# Altium project multimodal_hw_00.PrjPcb (part 2 of 2)

## Sheet 10-multimodal-microcontroller-rf.SchDoc
size A; SheetNumber: 7; SheetTotal: 11
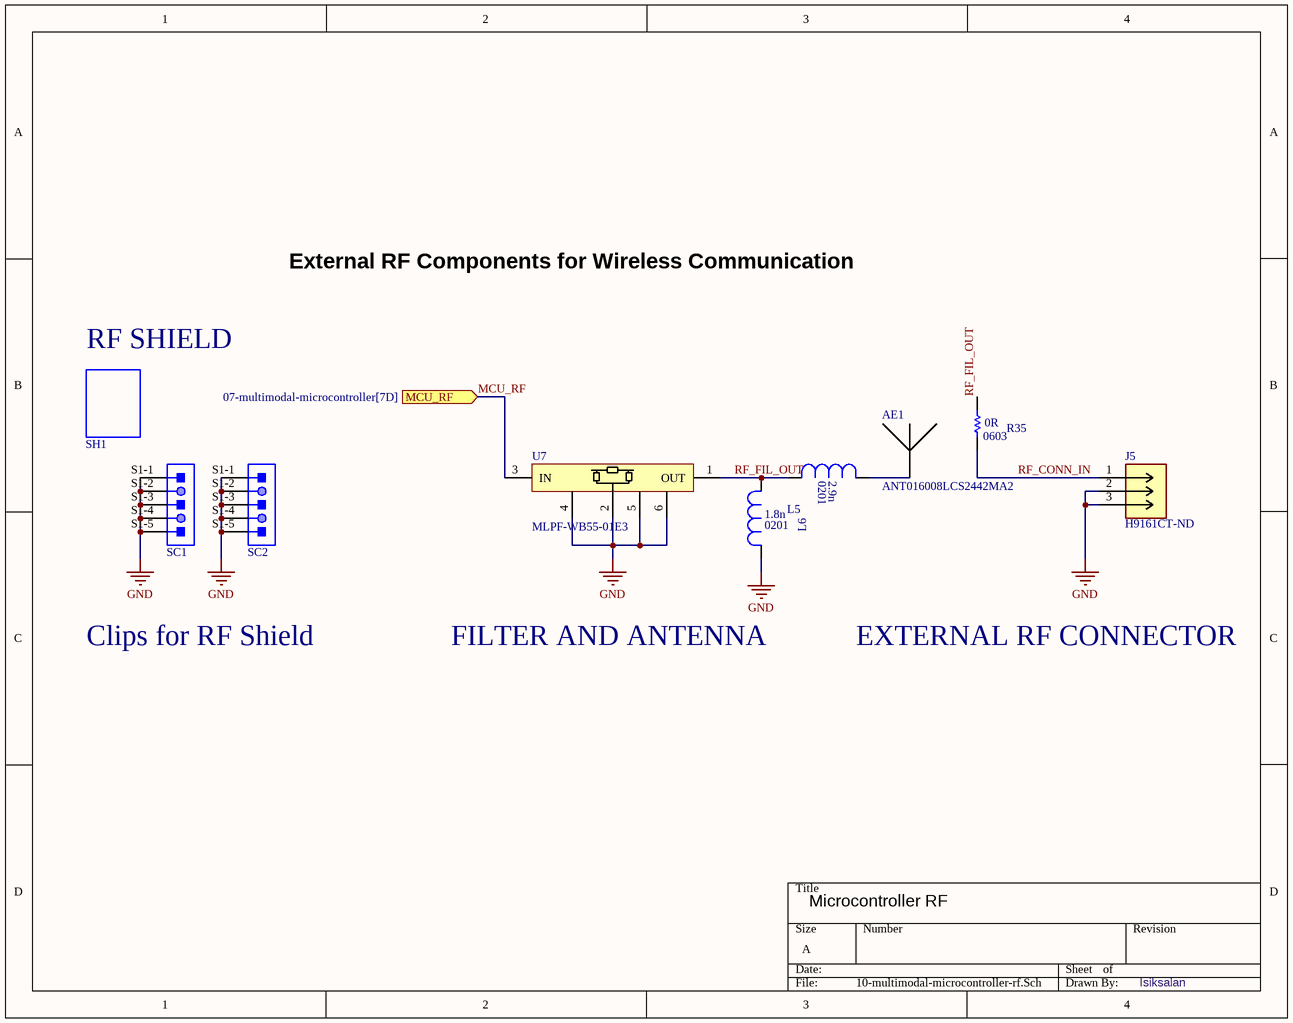
[diagram p11: 10-multimodal-microcontroller-rf.SchDoc]

### Parts
AE1  ANT016008LCS2442MA2  [ANTENNA]
J5  Supplier Part Number 1: H9161CT-ND  [RF-CONNECTOR]  (hidden comment: U.FL-R-SMT(10))
L5  MLG0603P1N8CT000  [INDTDK0201]  (value not drawn)
L6  MHQ0603P2N9ST000  [INDTDK0201]  (value not drawn)
R35  RMCF0603ZT0R00  [RES-STACK-POLE-0603]  (value not drawn)
SC1  S0951-46R  [RF-SHIELD+CLIP]  (value not drawn)
SC2  S0951-46R  [RF-SHIELD+CLIP]  (value not drawn)
SH1  MS190-10C  (value not drawn)
U7  MLPF-WB55-01E3  [Matched-Filter-2.4GHz]

### Ports
MCU_RF (in, see 07-multimodal-microcontroller[7D])

### Nets
GND: J5.2 J5.3 L5.2 SC1.S1-1 SC1.S1-2 SC1.S1-3 SC1.S1-4 SC1.S1-5 SC2.S1-1 SC2.S1-2 SC2.S1-3 SC2.S1-4 SC2.S1-5 U7.2 U7.4 U7.5 U7.6
MCU_RF: U7.3(IN) ; port MCU_RF
RF_CONN_IN: J5.1 R35.1
RF_FIL_OUT: L5.1 L6.2 R35.2 U7.1(OUT)
NetAE1_2: AE1.2 L6.1

### Notes on the sheet
- External RF Components for Wireless Communication
- RF SHIELD
- Clips for RF Shield
- FILTER AND ANTENNA
- EXTERNAL RF CONNECTOR
- Microcontroller RF
- Isiksalan
- (in symbol MHQ0603P2N9ST000) 0201; 2.9n
- (in symbol MLG0603P1N8CT000) 1.8n; 0201
- (in symbol RMCF0603ZT0R00) 0R; 0603

### Library data of the parts
AE1 = ANT016008LCS2442MA2: TDK - ANT016008LCS2442MA2 - Chip Antenna, ISM, 2.442 GHz, 50 Ohm, 1.6mm x 0.8mm x 0.4mm; Number of Bands: 1; Max Frequency: 27MHz; Supplier 1: Digi-Key; Manufacturer: TDK; Manufacturer Part Number: ANT016008LCS2442MA2; RoHS: Yes; Category: RF Antennas; Stock 1: 16359; Pricing 1: 1=0.72000, 10=0.63500, 25=0.59680, 100=0.48700, 250=0.45236, 500=0.38500, 1000=0.30800 (USD); Mount: Surface Mount; Case/Package: 0603; Number of Pins: 6; Packaging: Cut Tape; Termination: Solder; Height: 0.016inch; REACH SVHC: No SVHC; RoHS Compliant: Yes; ComponentLink1URL: http://www.farnell.com/datasheets/2294435.pdf?src-supplier=Farnell; ComponentLink1Description: http://www.farnell.com/datasheets/2294435.pdf?src-supplier=Farnell; ComponentLink2URL: https://product.tdk.com/info/en/documents/data_sheet/rf_ant_ant016008lcs2442ma2_summary_en.pdf?src-supplier=Digi-Key; ComponentLink2Description: https://product.tdk.com/info/en/documents/data_sheet/rf_ant_ant016008lcs2442ma2_summary_en.pdf?src-supplier=Digi-Key; ComponentLink3URL: https://product.tdk.com/info/en/documents/data_sheet/rf_ant_ant016008lcs2442ma2_en.pdf?src-supplier=Avnet; ComponentLink3Description: https://product.tdk.com/info/en/documents/data_sheet/rf_ant_ant016008lcs2442ma2_en.pdf?src-supplier=Avnet; ComponentLink4URL: http://www.farnell.com/datasheets/1932405.pdf?src-supplier=Element14; ComponentLink4Description: http://www.farnell.com/datasheets/1932405.pdf?src-supplier=Element14; Supplier Part Number 1: 445-172405CT-ND
J5 = U.FL-R-SMT(10): CONN U.FL RCPT STR 50 OHM SMD; Manufacturer: Hirose; Copyright: Copyright (C) 2021 Ultra Librarian. All rights reserved.; Manufacturer Part Number: U.FL-R-SMT(10); Digi-Key_Part_Number_1: H9161TR-ND; Digi-Key_Part_Number_2: H9161CT-ND; Digi-Key_Part_Number_3: H9161DKR-ND; Digi-Key_Part_Number_4: H9161TR-NDL; RefDes: RefDes; Type: DEV; Supplier 1: Digi-Key
L5 = MLG0603P1N8CT000: FIXED IND 1.8NH 700MA 100MOHM SM; Supplier 1: Digi-Key; Supplier Part Number 1: 445-172430-1-ND
L6 = MHQ0603P2N9ST000: FIXED IND 2.9NH 450MA 300MOHM SM; Supplier 1: Digi-Key; Supplier Part Number 1: 445-16842-6-ND
R35 = RMCF0603ZT0R00: RES 0 OHM JUMPER 1/10W 0603; Supplier 1: Digi-Key; Supplier Part Number 1: RMCF0603ZT0R00CT-ND
SC1 SC2 = S0951-46R: RFI SHIELD CLIP MINI TIN SMD; Supplier 1: Digi-Key; Supplier Part Number 1: 952-2669-1-ND
SH1 = MS190-10C: RF SHLD COVER 0.563"X0.764" SNAP; Supplier 1: Digi-Key; Supplier Part Number 1: 2333-MS190-10C-ND
U7 = MLPF-WB55-01E3: 2.4 GHz Matched filter companion chip for STM32WB55Cx and STM32WB55Rx; Manufacturer: STMicroelectronics; Supplier 1: Digi-Key; Manufacturer Part Number: MLPF-WB55-01E3; RoHS: Yes; Stock 1: 16369; Pricing 1: 1=0.30000, 10=0.28300, 25=0.26960, 50=0.26100, 100=0.25230, 250=0.23924, 500=0.20010, 1000=0.15530 (USD); ComponentLink1URL: http://www.farnell.com/datasheets/2802556.pdf?src-supplier=Farnell; ComponentLink1Description: http://www.farnell.com/datasheets/2802556.pdf?src-supplier=Farnell; ComponentLink2URL: http://www.farnell.com/datasheets/2802556.pdf?src-supplier=Newark; ComponentLink2Description: http://www.farnell.com/datasheets/2802556.pdf?src-supplier=Newark; Supplier Part Number 1: 497-19088-1-ND

## Nets that join several sheets
1V8A: 05-multimodal-analogfrontend (5 pins), 01-multimodal-powersupply (C11.1 TP11.1 U1.G3)
1V8D: 05-multimodal-analogfrontend (C31.1 C47.1 U5.D2), 01-multimodal-powersupply (C13.1 L10.1 TP13.1 U1.F2)
3V3_LED: 06-multimodal-analogfrontend-PPG (FB4.2), 01-multimodal-powersupply (C12.1 TP12.1 U1.A5)
3V3D: 05-multimodal-analogfrontend (5 pins), 13-multimodal-connections (J1.01), 12-multimodal-accelerometer (R36.2), 11-multimodal-combined-sensor (5 pins), 04-multimodal-flash (6 pins), 01-multimodal-powersupply (6 pins), 07-multimodal-microcontroller (23 pins)
5V_LED: 05-multimodal-analogfrontend (FB1.2 FB2.2), 06-multimodal-analogfrontend-PPG (FB3.2), 01-multimodal-powersupply (C9.1 C10.1 U1.B1 U1.B2)
GND: 05-multimodal-analogfrontend (19 pins), 06-multimodal-analogfrontend-PPG (C54.2 C55.2 C56.2 C57.2), 13-multimodal-connections (9 pins), 12-multimodal-accelerometer (8 pins), 11-multimodal-combined-sensor (5 pins), 04-multimodal-flash (C16.2 C17.2 U3.B3), 01-multimodal-powersupply (34 pins), 07-multimodal-microcontroller (18 pins), 08-multimodal-microcontroller-oscillators (6 pins), 10-multimodal-microcontroller-rf (17 pins)
USB_VBUS: 13-multimodal-connections (C62.1 CR1.5 J3.A4/B9 J3.B4/A9), 01-multimodal-powersupply (R3.2)
ACC_INT1: 12-multimodal-accelerometer (TP7.1 U4.5), 07-multimodal-microcontroller (U6.40)
ACC_INT2: 12-multimodal-accelerometer (TP8.1 U4.6), 07-multimodal-microcontroller (U6.39)
ADPD_INTR: 05-multimodal-analogfrontend (U5.C1), 07-multimodal-microcontroller (U6.50)
GREEN: 05-multimodal-analogfrontend (U5.A4 U5.B5), 06-multimodal-analogfrontend-PPG (D8.1 D8.3)
HSE_IN: 07-multimodal-microcontroller (U6.35), 08-multimodal-microcontroller-oscillators (C19.1 XO1.1)
HSE_OUT: 07-multimodal-microcontroller (U6.34), 08-multimodal-microcontroller-oscillators (C20.1 XO1.3)
I2C1_SCL: 12-multimodal-accelerometer (U4.4), 11-multimodal-combined-sensor (U8.4), 01-multimodal-powersupply (U1.D8), 07-multimodal-microcontroller (R31.1 U6.66)
I2C1_SDA: 12-multimodal-accelerometer (U4.2), 11-multimodal-combined-sensor (U8.3), 01-multimodal-powersupply (U1.E8), 07-multimodal-microcontroller (R32.1 U6.67)
INT: 01-multimodal-powersupply (R8.1 U1.G6), 07-multimodal-microcontroller (U6.64)
IR: 05-multimodal-analogfrontend (U5.A5), 06-multimodal-analogfrontend-PPG (D9.4)
LSE_IN: 07-multimodal-microcontroller (U6.3), 08-multimodal-microcontroller-oscillators (C45.1 XO2.1)
LSE_OUT: 07-multimodal-microcontroller (U6.4), 08-multimodal-microcontroller-oscillators (C46.1 XO2.2)
MCU_RF: 07-multimodal-microcontroller (U6.31), 10-multimodal-microcontroller-rf (U7.3)
NetCR1_1: 13-multimodal-connections (CR1.1), 07-multimodal-microcontroller (U6.53)
NetCR1_3: 13-multimodal-connections (CR1.3), 07-multimodal-microcontroller (U6.52)
NetJ1_02: 13-multimodal-connections (J1.02), 07-multimodal-microcontroller (U6.54)
NetJ1_04: 13-multimodal-connections (J1.04), 07-multimodal-microcontroller (U6.56)
NetJ1_06: 13-multimodal-connections (J1.06), 07-multimodal-microcontroller (U6.63)
NetR24_1: 05-multimodal-analogfrontend (R24.1 U5.A2), 07-multimodal-microcontroller (U6.46)
NetU5_A1: 05-multimodal-analogfrontend (U5.A1), 07-multimodal-microcontroller (U6.47)
NetU5_B1: 05-multimodal-analogfrontend (U5.B1), 07-multimodal-microcontroller (U6.48)
NetU5_B2: 05-multimodal-analogfrontend (U5.B2), 07-multimodal-microcontroller (U6.49)
PD1_SPO2: 05-multimodal-analogfrontend (U5.F2), 06-multimodal-analogfrontend-PPG (D3.2 D10.2)
PD2_SPO2: 05-multimodal-analogfrontend (U5.E2), 06-multimodal-analogfrontend-PPG (D11.2)
PFN2: 01-multimodal-powersupply (R9.1 U1.D6), 07-multimodal-microcontroller (U6.61)
QUAD_SPI_CSn: 04-multimodal-flash (R19.1 U3.C2), 07-multimodal-microcontroller (U6.17)
QUAD_SPI_IO0: 04-multimodal-flash (U3.D3), 07-multimodal-microcontroller (U6.6)
QUAD_SPI_IO1: 04-multimodal-flash (U3.D2), 07-multimodal-microcontroller (U6.7)
QUAD_SPI_IO2: 04-multimodal-flash (U3.C4), 07-multimodal-microcontroller (U6.22)
QUAD_SPI_IO3: 04-multimodal-flash (U3.D4), 07-multimodal-microcontroller (U6.21)
QUAD_SPI_SCK: 04-multimodal-flash (U3.B2), 07-multimodal-microcontroller (U6.18)
RED: 05-multimodal-analogfrontend (U5.A3), 06-multimodal-analogfrontend-PPG (D9.2)
RST_MCU: 13-multimodal-connections (J1.10), 04-multimodal-flash (D12.1), 01-multimodal-powersupply (R10.1), 07-multimodal-microcontroller (5 pins)
VC1: 05-multimodal-analogfrontend (D6.1 D7.1 U5.F3), 06-multimodal-analogfrontend-PPG (D3.1 D10.1 D11.1)